# EAGLE design VactrolMixer (EAGLE 6.6.0)
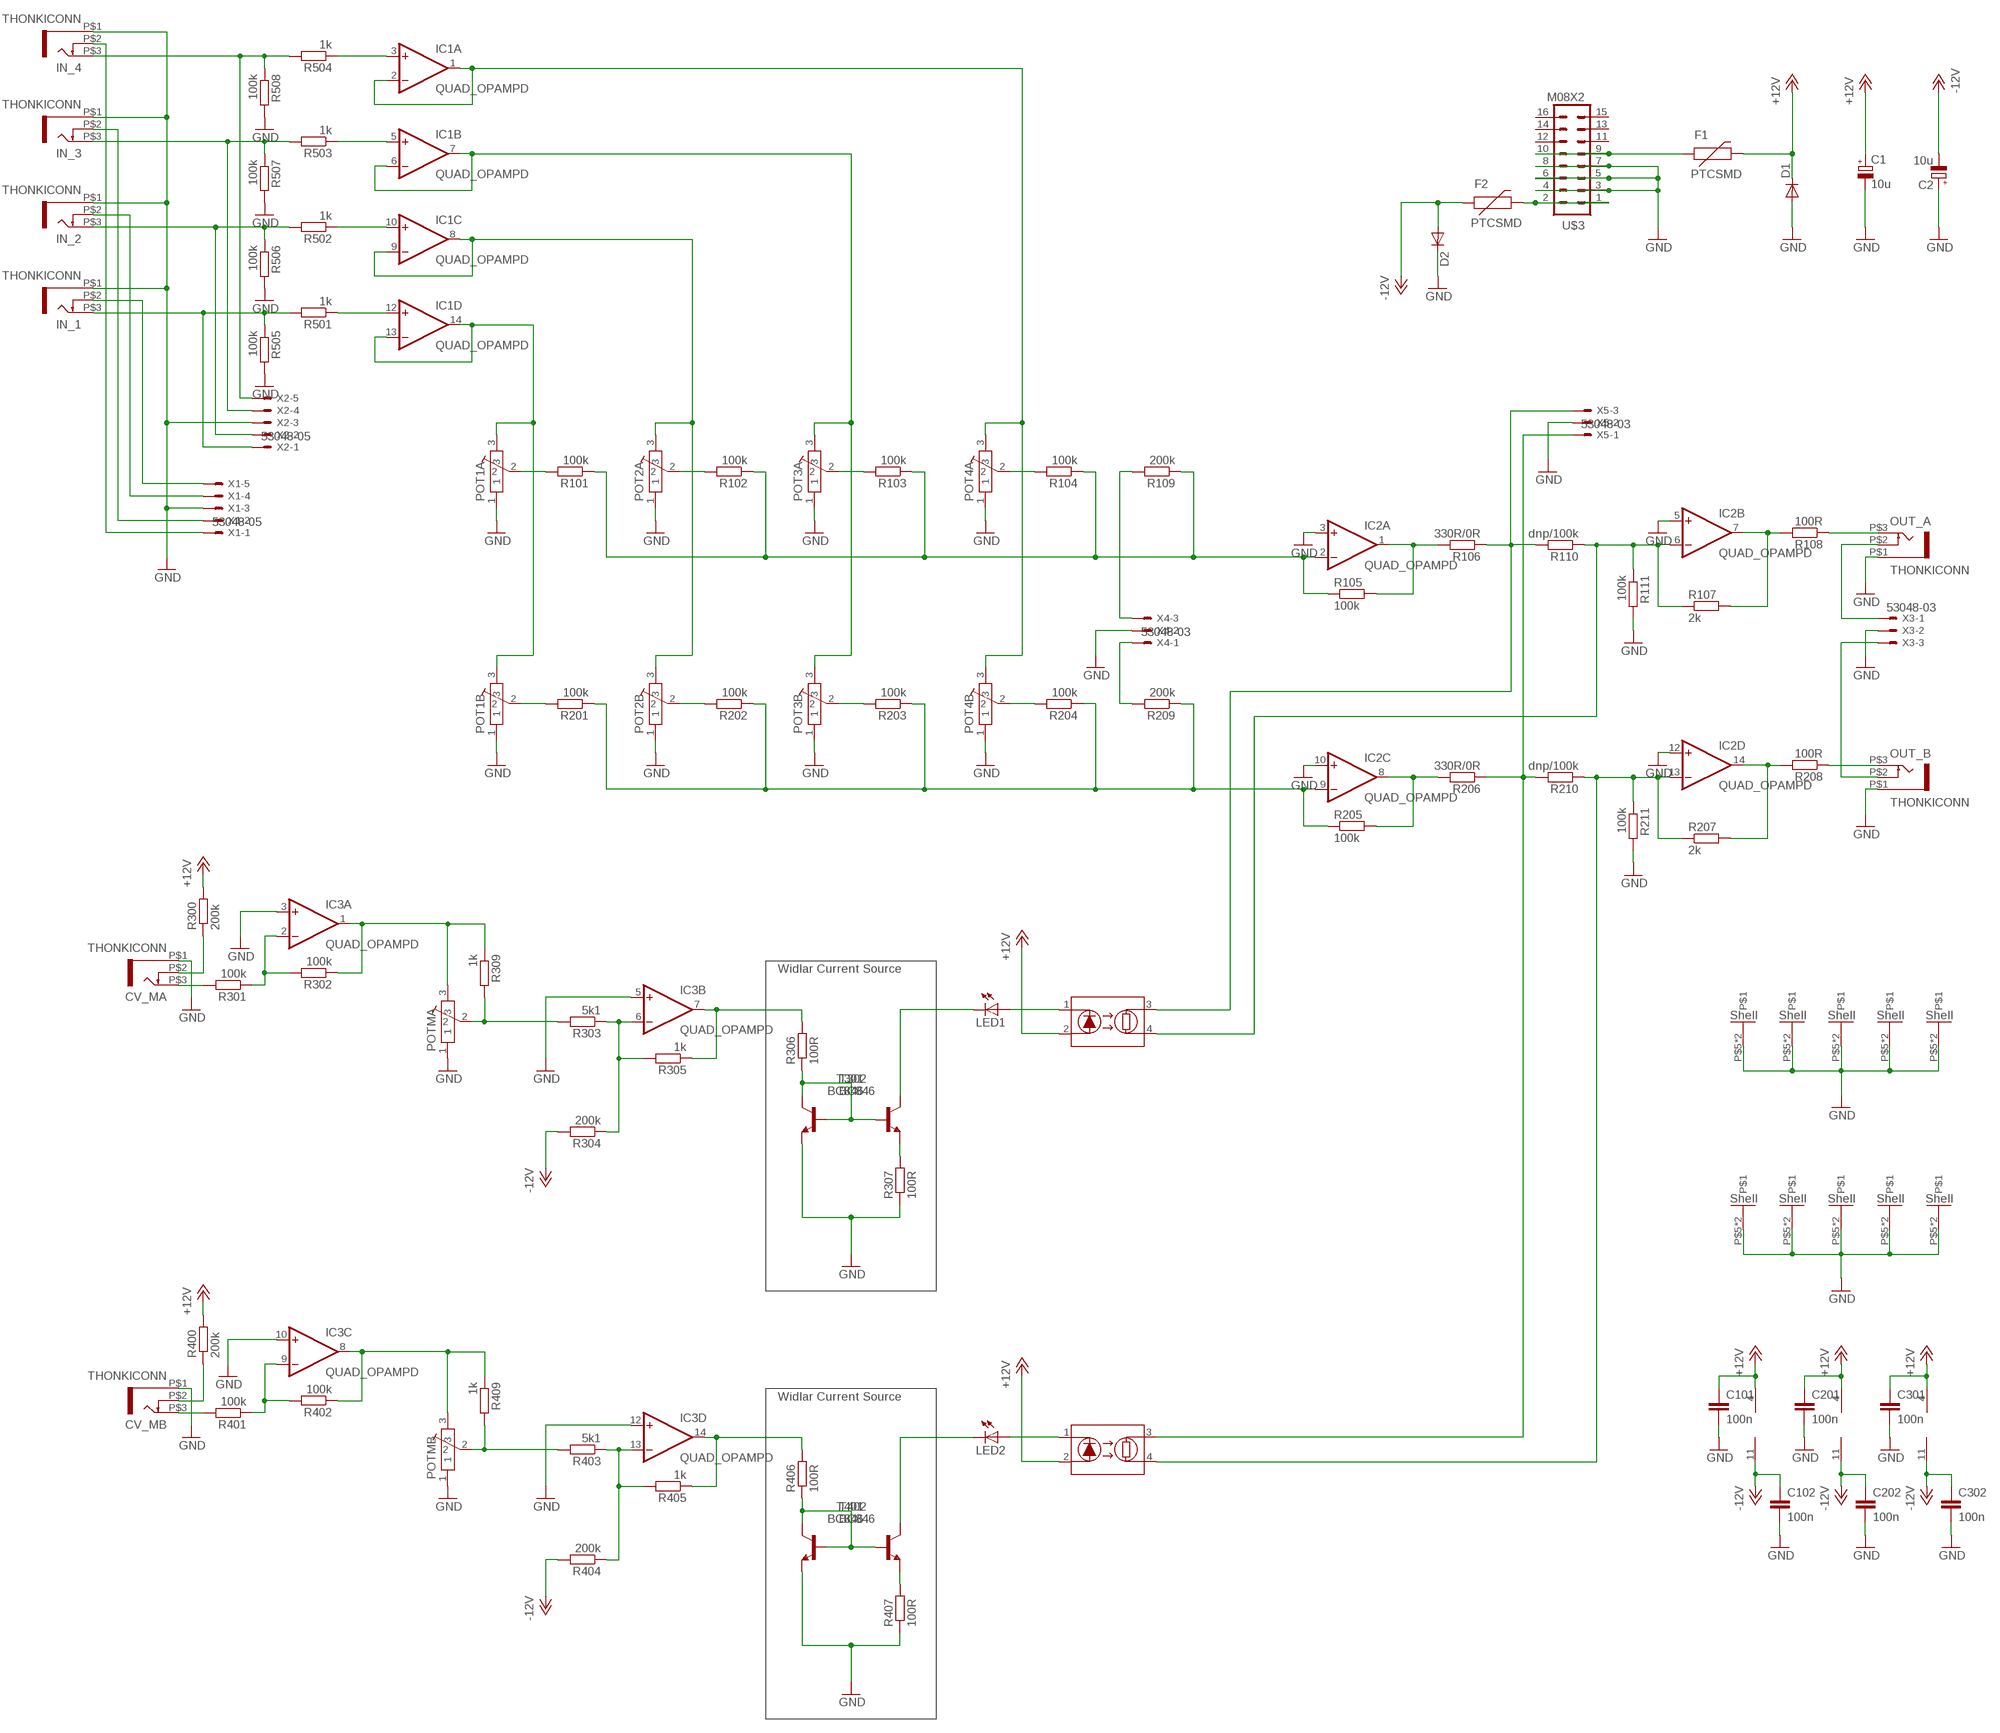
[diagram p0: schematic, sheet 1]

## Parts
C1  10u  CPOL-EU153CLV-0605  [153CLV-0605]
C2  10u  CPOL-EU153CLV-0605  [153CLV-0605]
C101  100n  C-EUC0603  [C0603]
C102  100n  C-EUC0603  [C0603]
C201  100n  C-EUC0603  [C0603]
C202  100n  C-EUC0603  [C0603]
C301  100n  C-EUC0603  [C0603]
C302  100n  C-EUC0603  [C0603]
CV_MA  THONKICONN  [THONKICONN]
CV_MB  THONKICONN  [THONKICONN]
D1  DIODESMA  [SMA-DIODE]
D2  DIODESMA  [SMA-DIODE]
F1  PTCSMD  [PTC-1206]
F2  PTCSMD  [PTC-1206]
IC1  QUAD_OPAMPD  [SO14]
IC2  QUAD_OPAMPD  [SO14]
IC3  QUAD_OPAMPD  [SO14]
IN_1  THONKICONN  [THONKICONN]
IN_2  THONKICONN  [THONKICONN]
IN_3  THONKICONN  [THONKICONN]
IN_4  THONKICONN  [THONKICONN]
LED1  LED3MM  [LED3MM]
LED2  LED3MM  [LED3MM]
OUT_A  THONKICONN  [THONKICONN]
OUT_B  THONKICONN  [THONKICONN]
POT1A  POT-ALPS-RK09L1140  [POT-ALPS-RK09L1140]
POT1B  POT-ALPS-RK09L1140  [POT-ALPS-RK09L1140]
POT2A  POT-ALPS-RK09L1140  [POT-ALPS-RK09L1140]
POT2B  POT-ALPS-RK09L1140  [POT-ALPS-RK09L1140]
POT3A  POT-ALPS-RK09L1140  [POT-ALPS-RK09L1140]
POT3B  POT-ALPS-RK09L1140  [POT-ALPS-RK09L1140]
POT4A  POT-ALPS-RK09L1140  [POT-ALPS-RK09L1140]
POT4B  POT-ALPS-RK09L1140  [POT-ALPS-RK09L1140]
POTMA  POT-ALPS-RK09L1140  [POT-ALPS-RK09L1140]
POTMB  POT-ALPS-RK09L1140  [POT-ALPS-RK09L1140]
R101  100k  R-EU_R0603  [R0603]
R102  100k  R-EU_R0603  [R0603]
R103  100k  R-EU_R0603  [R0603]
R104  100k  R-EU_R0603  [R0603]
R105  100k  R-EU_R0603  [R0603]
R106  330R/0R  R-EU_R0603  [R0603]
R107  2k  R-EU_R0603  [R0603]
R108  100R  R-EU_R0603  [R0603]
R109  200k  R-EU_R0603  [R0603]
R110  dnp/100k  R-EU_R0603  [R0603]
R111  100k  R-EU_R0603  [R0603]
R201  100k  R-EU_R0603  [R0603]
R202  100k  R-EU_R0603  [R0603]
R203  100k  R-EU_R0603  [R0603]
R204  100k  R-EU_R0603  [R0603]
R205  100k  R-EU_R0603  [R0603]
R206  330R/0R  R-EU_R0603  [R0603]
R207  2k  R-EU_R0603  [R0603]
R208  100R  R-EU_R0603  [R0603]
R209  200k  R-EU_R0603  [R0603]
R210  dnp/100k  R-EU_R0603  [R0603]
R211  100k  R-EU_R0603  [R0603]
R300  200k  R-EU_R0603  [R0603]
R301  100k  R-EU_R0603  [R0603]
R302  100k  R-EU_R0603  [R0603]
R303  5k1  R-EU_R0603  [R0603]
R304  200k  R-EU_R0603  [R0603]
R305  1k  R-EU_R0603  [R0603]
R306  100R  R-EU_R0603  [R0603]
R307  100R  R-EU_R0603  [R0603]
R309  1k  R-EU_R0603  [R0603]
R400  200k  R-EU_R0603  [R0603]
R401  100k  R-EU_R0603  [R0603]
R402  100k  R-EU_R0603  [R0603]
R403  5k1  R-EU_R0603  [R0603]
R404  200k  R-EU_R0603  [R0603]
R405  1k  R-EU_R0603  [R0603]
R406  100R  R-EU_R0603  [R0603]
R407  100R  R-EU_R0603  [R0603]
R409  1k  R-EU_R0603  [R0603]
R501  1k  R-EU_R0603  [R0603]
R502  1k  R-EU_R0603  [R0603]
R503  1k  R-EU_R0603  [R0603]
R504  1k  R-EU_R0603  [R0603]
R505  100k  R-EU_R0603  [R0603]
R506  100k  R-EU_R0603  [R0603]
R507  100k  R-EU_R0603  [R0603]
R508  100k  R-EU_R0603  [R0603]
T301  BC846  [SOT23]
T302  BC846  [SOT23]
T401  BC846  [SOT23]
T402  BC846  [SOT23]
U$3  M08X2  [2X8]
VAC1  VTL5C3  [VTL5C3]
VAC2  VTL5C3  [VTL5C3]
X1  53048-05  [53048-05]
X2  53048-05  [53048-05]
X3  53048-03  [53048-03]
X4  53048-03  [53048-03]
X5  53048-03  [53048-03]

## Nets
+12V: C1.+ C101.1 C201.1 C301.1 D1.C F1.2 IC1.4(P:V+) IC2.4(P:V+) IC3.4(P:V+) R300.2 R400.2 VAC1.2(LED+) VAC2.2(LED+)
-12V: C2.- C102.1 C202.1 C302.1 D2.A F2.1 IC1.11(P:V-) IC2.11(P:V-) IC3.11(P:V-) R304.2 R404.2
CV_SW_A: CV_MA.P$2 R300.1
CV_SW_B: CV_MB.P$2 R400.1
GND: C1.- C2.+ C101.2 C102.2 C201.2 C202.2 C301.2 C302.2 CV_MA.P$1 CV_MB.P$1 D1.A D2.C IC2.3(A:+IN) IC2.5(B:+IN) IC2.10(C:+IN) IC2.12(D:+IN) IC3.3(A:+IN) IC3.5(B:+IN) IC3.10(C:+IN) IC3.12(D:+IN) IN_1.P$1 IN_2.P$1 IN_3.P$1 IN_4.P$1 OUT_A.P$1 OUT_B.P$1 POT1A.1 POT1A.P$5 POT1A.P$6 POT1B.1 POT1B.P$5 POT1B.P$6 POT2A.1 POT2A.P$5 POT2A.P$6 POT2B.1 POT2B.P$5 POT2B.P$6 POT3A.1 POT3A.P$5 POT3A.P$6 POT3B.1 POT3B.P$5 POT3B.P$6 POT4A.1 POT4A.P$5 POT4A.P$6 POT4B.1 POT4B.P$5 POT4B.P$6 POTMA.1 POTMA.P$5 POTMA.P$6 POTMB.1 POTMB.P$5 POTMB.P$6 R111.2 R211.2 R307.1 R407.1 R505.2 R506.2 R507.2 R508.2 T301.2(E) T401.2(E) U$3.3 U$3.4 U$3.5 U$3.6 U$3.7 U$3.8 X1.3 X2.3 X3.2 X4.2 X5.2
IN_1: IN_1.P$3 R501.2 R505.1 X2.1
IN_2: IN_2.P$3 R502.2 R506.1 X2.2
IN_3: IN_3.P$3 R503.2 R507.1 X2.4
IN_4: IN_4.P$3 R504.2 R508.1 X2.5
IN_5_A: R109.2 X4.3
IN_5_B: R209.2 X4.1
INV_OUT_A: R106.1 R110.2 VAC1.3(LDRA) X5.3
INV_OUT_B: R206.1 R210.2 VAC2.3(LDRA) X5.1
N$1: IC2.7(B:OUT) R107.2 R108.2
N$2: POT2B.2 R202.2
N$6: IC1.3(A:+IN) R504.1
N$7: CV_MA.P$3 R301.2
N$8: IC2.1(A:OUT) R105.2 R106.2
N$9: IC2.8(C:OUT) R205.2 R206.2
N$10: POT3B.2 R203.2
N$11: IC2.6(B:-IN) R107.1 R110.1 R111.1 VAC1.4(LDRB)
N$13: POT1A.2 R101.2
N$14: IC2.14(D:OUT) R207.2 R208.2
N$15: LED2.A VAC2.1(LED-)
N$17: IC1.5(B:+IN) R503.1
N$19: POT4B.2 R204.2
N$20: CV_MB.P$3 R401.2
N$21: IC1.8(C:OUT) IC1.9(C:-IN) POT2A.3 POT2B.3
N$24: IC1.13(D:-IN) IC1.14(D:OUT) POT1A.3 POT1B.3
N$25: POT4A.2 R104.2
N$27: R407.2 T402.2(E)
N$28: R406.1 T401.1(B) T401.3(C) T402.1(B)
N$29: LED2.K(C) T402.3(C)
N$31: POT3A.2 R103.2
N$33: POT1B.2 R201.2
N$34: POT2A.2 R102.2
N$35: R307.2 T302.2(E)
N$36: IC2.13(D:-IN) R207.1 R210.1 R211.1 VAC2.4(LDRB)
N$39: LED1.A VAC1.1(LED-)
N$40: LED1.K(C) T302.3(C)
N$42: IC3.7(B:OUT) R305.1 R306.2
N$44: R306.1 T301.1(B) T301.3(C) T302.1(B)
N$46: IC2.9(C:-IN) R201.1 R202.1 R203.1 R204.1 R205.1 R209.1
N$48: IC1.10(C:+IN) R502.1
N$50: IC1.12(D:+IN) R501.1
N$52: IC2.2(A:-IN) R101.1 R102.1 R103.1 R104.1 R105.1 R109.1
N$53: IC1.6(B:-IN) IC1.7(B:OUT) POT3A.3 POT3B.3
N$56: F1.1 U$3.9 U$3.10
N$57: F2.2 U$3.1 U$3.2
N$58: IC1.1(A:OUT) IC1.2(A:-IN) POT4A.3 POT4B.3
N$59: IC3.2(A:-IN) R301.1 R302.2
N$61: IC3.1(A:OUT) POTMA.3 R302.1 R309.1
N$64: IC3.6(B:-IN) R303.1 R304.1 R305.2
N$65: POTMA.2 R303.2 R309.2
N$67: IC3.9(C:-IN) R401.1 R402.2
N$69: IC3.8(C:OUT) POTMB.3 R402.1 R409.1
N$71: IC3.14(D:OUT) R405.1 R406.2
N$72: IC3.13(D:-IN) R403.1 R404.1 R405.2
N$73: POTMB.2 R403.2 R409.2
OUT_A: OUT_A.P$3 R108.1
OUT_B: OUT_B.P$3 R208.1
SW_IN_1: IN_1.P$2 X1.5
SW_IN_2: IN_2.P$2 X1.4
SW_IN_3: IN_3.P$2 X1.2
SW_IN_4: IN_4.P$2 X1.1
SW_OUT_A: OUT_A.P$2 X3.1
SW_OUT_B: OUT_B.P$2 X3.3
Unconnected: U$3.11 U$3.12 U$3.13 U$3.14 U$3.15 U$3.16

## Notes on the sheet
- Widlar Current Source
- Widlar Current Source

## Library data of the parts
C1 C2 = resistor:CPOL-EU: POLARIZED CAPACITOR, European symbol
C101 C102 C201 C202 C301 C302 = resistor:C-EU: CAPACITOR, European symbol
CV_MA CV_MB IN_1-IN_4 OUT_A OUT_B = Rebel:THONKICONN
D1 D2 = SparkFun:DIODE: Diode These are standard reverse protection diodes and small signal diodes. SMA package can handle up to about 1A. SOD-323 can handle about 200mA. What the SOD-323 package when ordering, there are some mfgs out there that are 5-pin packages.
F1 F2 = SparkFun:PTC: Resettable Fuse PTC Resettable Fuse. Spark Fun Electronics SKU : COM-08357
IC1-IC3 = adafruit:QUAD_OPAMP: OP AMP Standard quad package
LED1 LED2 = Rebel:LED: LED
POT1A POT1B POT2A POT2B POT3A POT3B POT4A POT4B POTMA POTMB = Rebel:POT-ALPS-RK09L
R101-R111 R201-R211 R300-R307 R309 R400-R407 R409 R501-R508 = resistor:R-EU_: RESISTOR, European symbol
T301 T302 T401 T402 = transistor:BC846: NPN TRANSISTOR
U$3 = SparkFun:M08X2
VAC1 VAC2 = Pingdynasty:VTL5C3
X1 X2 = con-molex:53?-05: CONNECTOR wire to board 1.25 mm (.049 inch) pitch header; MF: MOLEX; MPN: 53048-0510; OC_FARNELL: 9732926; OC_NEWARK: 57H4722
X3-X5 = con-molex:53?-03: CONNECTOR wire to board 1.25 mm (.049 inch) pitch header; MF: WALDOM/MOLEX; MPN: 53048-0310; OC_FARNELL: 9732918; OC_NEWARK: 38C9908

## Board
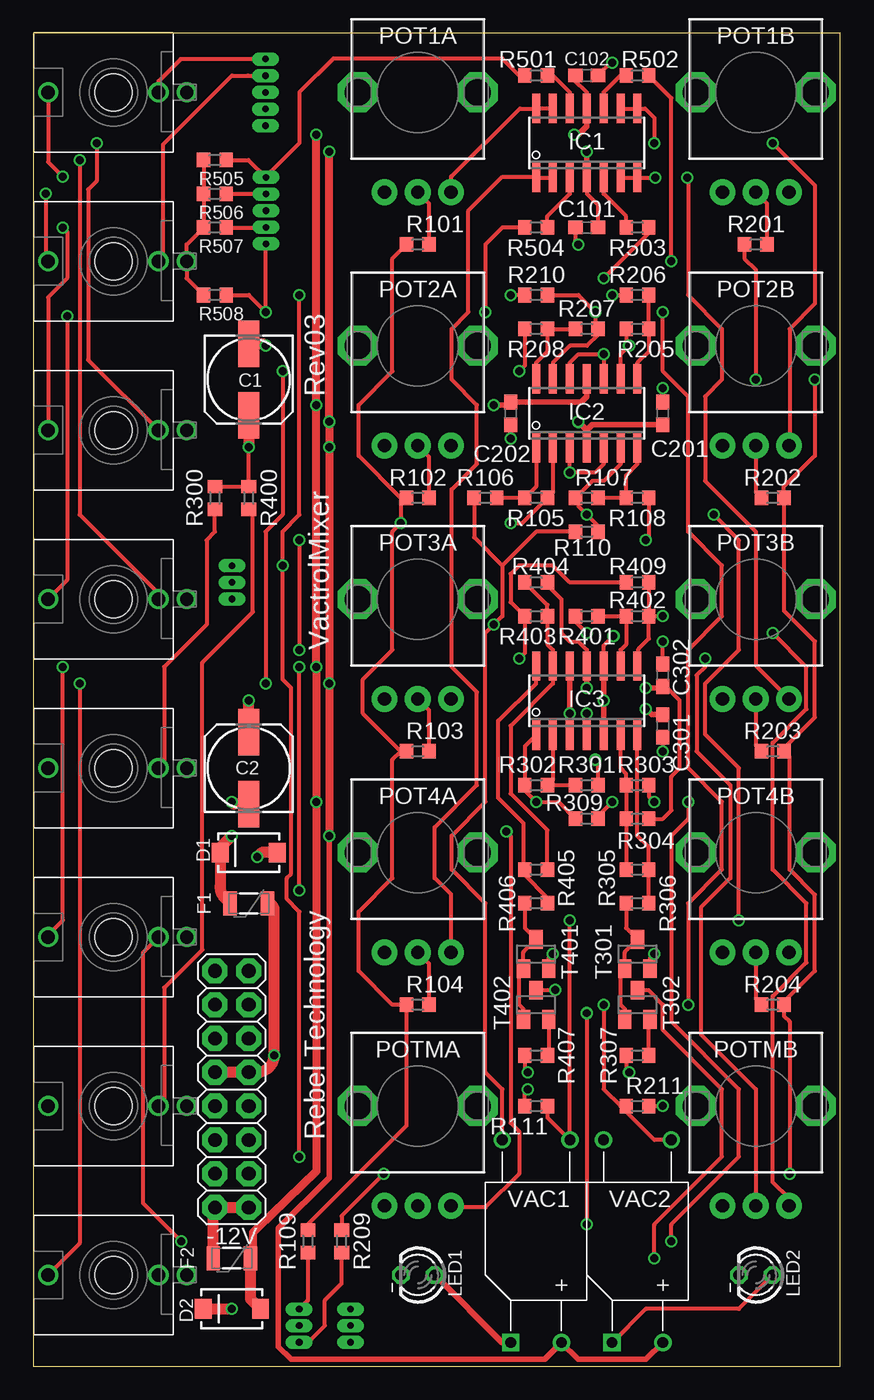
[diagram p1: board, top side]
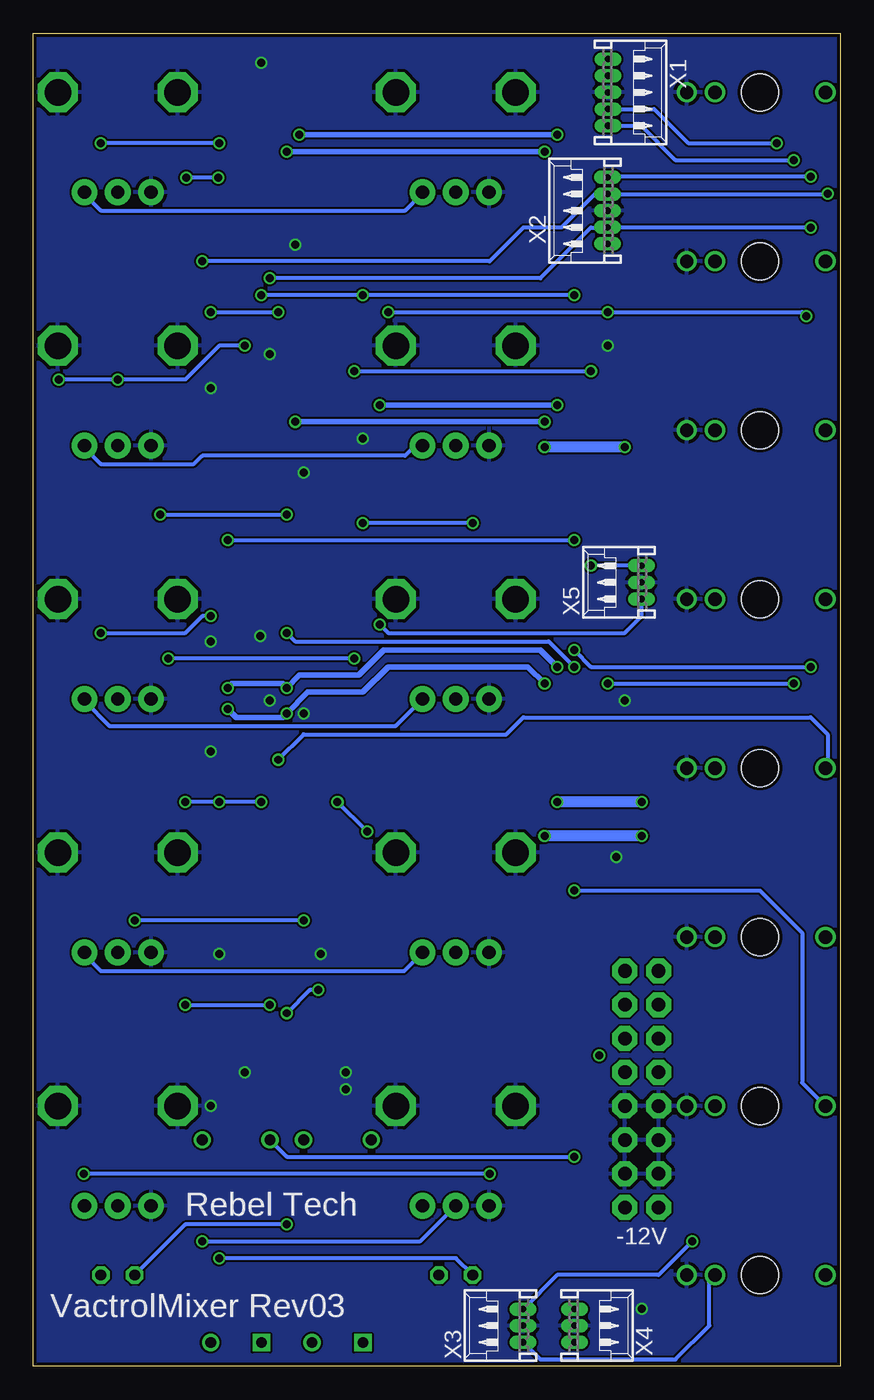
[diagram p2: board, bottom side, seen from below]

Size 60.64 x 100.2 mm. Coordinates in mm from the lower left corner, seen from the top.
Outline: 60.64,0 60.64,100.2 0,100.2 0,0 60.64,0
Copper layers (1*16): Top 0.035mm / dielectric 1.5mm / Bottom 0.035mm
Design rules "Fusion_eagle_rule_v1.1": minimum track width 6mil, minimum drill 12mil, track to track 6mil, track to pad 6mil, pad to pad 6mil, via to via 6mil, smd to smd 0mil, copper to edge 10mil, drill to drill 10mil, minimum pad ring 10mil, minimum via ring 6mil, stop-mask expansion 2mil, vias tented up to drill 100mil, thermal gap 10mil

### Footprints (pad centres in the part's own frame; a part is rotated, then mirrored left to right if it is on the bottom)
153CLV-0605 = smd 3.5 x 1.6: + 2.7,0; - -2.7,0
C0603 = smd 1.1 x 1: 1 -0.85,0; 2 0.85,0
THONKICONN = drill 1: P$1 0,-5.5; P$2 0,-3.38; P$3 0,4.92 | hole 2.8: 0,0
SMA-DIODE = smd 1.27 x 1.47: A -2.15,0; C 2.15,0
PTC-1206 = smd 1 x 1.8: 1 -1.4,0; 2 1.4,0
SO14 = smd 0.6 x 2.2: 1 -3.81,-2.6; 2 -2.54,-2.6; 3 -1.27,-2.6; 4 0,-2.6; 5 1.27,-2.6; 6 2.54,-2.6; 7 3.81,-2.6; 8 3.81,2.6; 9 2.54,2.6; 10 1.27,2.6; 11 0,2.6; 12 -1.27,2.6; 13 -2.54,2.6; 14 -3.81,2.6
LED3MM = drill 0.813 octagon: A -1.27,0; K 1.27,0
POT-ALPS-RK09L1140 = drill 1 pad 1.93: 1 -2.5,-7.5; 2 0,-7.5; 3 2.5,-7.5 | drill 2 octagon: P$5 -4.5,0; P$6 4.5,0
R0603 = smd 1 x 1.1: 1 -0.85,0; 2 0.85,0
SOT23 = smd 1 x 1.4: 1 -0.95,-1.1; 2 0.95,-1.1; 3 0,1.1
2X8 = drill 1.016 pad 1.88 octagon: 1 0,0; 2 0,2.54; 3 2.54,0; 4 2.54,2.54; 5 5.08,0; 6 5.08,2.54; 7 7.62,0; 8 7.62,2.54; 9 10.16,0; 10 10.16,2.54; 11 12.7,0; 12 12.7,2.54; 13 15.24,0; 14 15.24,2.54; 15 17.78,0; 16 17.78,2.54
VTL5C3 = drill 0.8 square: 1 -7.62,1.905 | drill 0.8: 2 -7.62,-1.905; 3 7.62,2.54; 4 7.62,-2.54
53048-05 = drill 0.5 pad 0.698 long: 1 2.5,-1.25; 2 1.25,-1.25; 3 0,-1.25; 4 -1.25,-1.25; 5 -2.5,-1.25
53048-03 = drill 0.5 pad 0.698 long: 1 1.25,-1.25; 2 0,-1.25; 3 -1.25,-1.25

### Placement (x,y rotation side)
C1  16.19,74.17 270 top
C2  16.19,44.96 90 top
C101  41.59,85.6 180 top
C102  41.59,97.03 0 top
C201  47.31,71.63 90 top
C202  35.88,71.63 270 top
C301  47.31,48.13 270 top
C302  47.31,51.94 90 top
CV_MA  6.03,44.96 90 top
CV_MB  6.03,19.56 90 top
D1  16.19,38.61 180 top
D2  14.92,4.32 180 top
F1  16.19,34.8 180 top
F2  14.92,8.13 180 top
IC1  41.59,91.95 0 top
IC2  41.59,71.63 0 top
IC3  41.59,50.04 0 top
IN_1  6.03,95.76 90 top
IN_2  6.03,83.06 90 top
IN_3  6.03,70.36 90 top
IN_4  6.03,57.66 90 top
LED1  28.89,6.86 180 top
LED2  54.29,6.86 180 top
OUT_A  6.03,32.26 90 top
OUT_B  6.03,6.86 90 top
POT1A  28.89,95.76 0 top
POT1B  54.29,95.76 0 top
POT2A  28.89,76.71 0 top
POT2B  54.29,76.71 0 top
POT3A  28.89,57.66 0 top
POT3B  54.29,57.66 0 top
POT4A  28.89,38.61 0 top
POT4B  54.29,38.61 0 top
POTMA  28.89,19.56 0 top
POTMB  54.29,19.56 0 top
R101  28.89,84.33 0 top
R102  28.89,65.28 0 top
R103  28.89,46.23 0 top
R104  28.89,27.18 0 top
R105  37.78,65.28 180 top
R106  33.97,65.28 0 top
R107  41.59,65.28 0 top
R108  45.4,65.28 180 top
R109  20.64,9.4 270 top
R110  41.59,62.74 180 top
R111  37.78,19.56 180 top
R201  54.29,84.33 0 top
R202  55.56,65.28 180 top
R203  55.56,46.23 180 top
R204  55.56,27.18 180 top
R205  45.4,77.98 0 top
R206  45.4,80.52 0 top
R207  41.59,77.98 180 top
R208  37.78,77.98 0 top
R209  23.18,9.4 270 top
R210  37.78,80.52 180 top
R211  45.4,19.56 0 top
R300  13.65,65.28 90 top
R301  41.59,43.69 0 top
R302  37.78,43.69 0 top
R303  45.4,43.69 0 top
R304  45.4,41.15 0 top
R305  45.4,37.34 180 top
R306  45.4,34.8 0 top
R307  45.4,23.37 0 top
R309  41.59,41.15 0 top
R400  16.19,65.28 90 top
R401  41.59,56.39 180 top
R402  45.4,56.39 180 top
R403  37.78,56.39 180 top
R404  37.78,58.93 0 top
R405  37.78,37.34 0 top
R406  37.78,34.8 0 top
R407  37.78,23.37 0 top
R409  45.4,58.93 180 top
R501  37.78,97.03 180 top
R502  45.4,97.03 0 top
R503  45.4,85.6 0 top
R504  37.78,85.6 180 top
R505  13.65,90.68 180 top
R506  13.65,88.14 180 top
R507  13.65,85.6 180 top
R508  13.65,80.52 180 top
T301  45.4,30.99 0 top
T302  45.4,27.18 0 top
T401  37.78,30.99 0 top
T402  37.78,27.18 0 top
U$3  16.19,11.94 90 top
VAC1  37.78,9.4 90 top
VAC2  45.4,9.4 90 top
X1  16.19,95.76 270 bottom
X2  18.73,86.87 90 bottom
X3  25.08,3.05 90 bottom
X4  18.73,3.05 270 bottom
X5  16.19,58.93 90 bottom

### Tracks (layer width: path | path; a pad name or v marks a point on that pad's centre or on a via)
+12V  (via drill 0.6)
  Top 0.305: R300.2 R400.2 v16.19,69.09 | IC1.4 41.59,88.14 42.44,87.29 C101.1
  Top 0.406: v22.22,39.88 22.22,14.16 18.42,10.35 18.42,1.46 19.37,0.51 38.42,0.51 VAC1.2 40.96,0.51 46.04,0.51 VAC2.2 | v41.59,91.31 IC1.4 | IC2.4 41.59,70.36 | 41.59,70.36 v40.96,70.99 | C201.1 42.01,70.78 41.59,70.36 | IC3.4 v41.59,49.09 | C301.1 46.46,48.98 v46.04,49.4
  Top 0.61: v22.22,91.31 v22.22,70.99 v22.22,69.09 v22.22,51.31 v22.22,39.88
  Top 0.813: F1.2 14.41,35.18 arc-45 14.04,36.07 D1.C 14.04,39 v14.92,39.88 | C1.+ v16.19,69.09
  Bottom 0.406: v40.96,70.99 v22.22,70.99 | v22.22,51.31 23.49,52.58 33.97,52.58 35.88,50.67 40.01,50.67 v41.59,49.09 41.91,48.77 45.4,48.77 v46.04,49.4 | v22.22,91.31 v41.59,91.31
  Bottom 0.813: v16.19,69.09 v22.22,69.09 | v14.92,39.88 v22.22,39.88
-12V  (via drill 0.6)
  Top 0.305: R404.2 38.63,58.71 39.69,57.66 39.69,55.12 40.32,54.48 40.96,54.48 41.59,53.85 IC3.11 | R304.2 47.31,41.15 47.94,41.78 47.94,44.32 48.58,44.96 48.58,50.04 47.52,51.09 C302.1 | IC1.11 41.59,95.76 40.74,96.61 C102.1 | 21.27,14.79 21.27,14.67
  Top 0.406: IC1.11 41.59,93.22 40.96,92.58 v40.64,92.58 | IC2.11 41.59,72.9 41.17,72.48 C202.1 35.66,72.26 v34.61,72.26 | v46.04,50.99 47.2,50.99 C302.1 | IC3.11 v41.59,50.99
  Top 0.61: v21.27,92.58 v21.27,72.26 v21.27,52.58 v21.27,42.42 21.27,14.79 | 21.27,14.67 16.83,10.35 16.51,10.03 16.51,8.76 16.19,8.45 16.32,8.32 F2.1
  Top 0.813: C2.- 15.08,42.26 v14.92,42.42 | F2.1 16.32,5.07 D2.A
  Bottom 0.406: v34.61,72.26 v21.27,72.26 | v21.27,52.58 22.54,53.85 34.29,53.85 36.19,51.94 40.64,51.94 v41.59,50.99 41.91,51.31 45.72,51.31 v46.04,50.99 | v21.27,92.58 v40.64,92.58
  Bottom 0.813: v14.92,42.42 v21.27,42.42
CV_SW_A
  Top 0.305: 13.65,64.01 R300.1 13.65,62.74 13.02,62.1 13.02,55.75 9.84,52.58 9.84,45.39 CV_MA.P$2
CV_SW_B
  Top 0.305: R400.1 16.19,64.33 16.51,64.01 16.51,56.71 12.7,52.89 12.7,31.31 9.84,28.45 9.84,19.99 CV_MB.P$2
GND  (via drill 0.6)
  Top 0.305: IC2.12 40.32,75.44 40.96,76.07 v42.86,76.07 IC2.10 | IC2.5 42.86,67.82 42.23,67.18 v40.32,67.18 IC2.3 | R307.1 44.55,22.31 v44.77,22.1 | R407.1 36.93,22.31 v37.15,22.1 | T401.2 38.73,30.67 v39.05,30.99 | T301.2 46.35,30.67 v46.67,30.99 | C102.2 42.44,97.24 v43.5,97.98 | C101.2 40.74,84.54 v40.96,84.33 | C301.2 v47.31,46.23 | C302.2 v47.31,54.48 | IC3.10 42.86,54.17 v43.6,54.9 | R111.2 36.93,20.61 v37.15,20.83 | R211.2 v47.31,19.56 | R505.2 R506.2 R507.2 11.53,84.33 IN_2.P$1 11.53,81.79 R508.2
  Top 0.406: C201.2 v47.31,73.53 | C202.2 v35.88,69.72 | IC3.10 v42.86,50.04 IC3.5 | IC3.12 v40.32,49.09 IC3.3
  Top 0.813: C1.- 17.3,76.87 v17.46,76.71 | C2.+ v16.19,50.04 | D1.A 17.15,38.61 v16.83,38.29 | D2.C v14.92,4.32
  pour Bottom: -1.59,102.11 -1.59,-0.76 60.64,-0.76 60.64,102.11
IN_1  (via drill 0.6)
  Top 0.305: R501.2 36.51,97.03 35.24,98.3 22.54,98.3 20,95.76 20,91.95 17.42,89.37 X2.1 16.17,90.68 R505.1 | IN_1.P$3 1.11,90.52 v2.22,89.41
  Bottom 0.305: v2.22,89.41 17.44,89.41 X2.1
IN_2  (via drill 0.6)
  Top 0.305: v47.94,83.06 47.94,95.34 R502.2 | v0.95,88.14 0.95,83.22 IN_2.P$3 | R506.1 17.46,88.14 X2.2
  Bottom 0.305: v47.94,83.06 26.35,83.06 23.81,85.6 20.96,85.6 18.42,88.14 17.5,88.14 X2.2 0.97,88.12 v0.95,88.14
IN_3  (via drill 0.6)
  Top 0.305: v42.86,81.79 46.25,85.18 R503.2 | v2.22,85.6 2.54,85.28 2.54,81.78 1.11,80.36 IN_3.P$3 | R507.1 17.46,85.6 X2.4
  Bottom 0.305: v42.86,81.79 22.54,81.79 18.73,85.6 17.5,85.6 X2.4 17.46,85.6 v2.22,85.6
IN_4  (via drill 0.6)
  Top 0.305: R504.2 35.24,85.6 33.97,84.33 v33.97,79.25 | v2.54,78.93 2.54,59.09 IN_4.P$3 | X2.5 17.46,84.35 v17.46,79.25 16.19,80.52 R508.1
  Bottom 0.305: v33.97,79.25 v17.46,79.25 2.86,79.25 v2.54,78.93
IN_5_A
  Top 0.305: R109.2 20.64,4.95 X4.3
IN_5_B
  Top 0.305: X4.1 20.66,1.8 21.91,3.05 21.91,4.95 23.18,6.22 R209.2
INV_OUT_A  (via drill 0.6)
  Top 0.305: VAC1.3 35.24,20.83 33.97,22.1 33.97,34.8 31.43,37.34 31.43,39.88 33.97,42.42 33.97,55.12 v34.61,55.75 35.24,56.39 35.24,60.2 | R106.1 33.12,62.32 35.24,60.2 | R110.2 37.78,62.74 35.24,60.2
  Bottom 0.305: v34.61,55.75 33.97,55.12 16.19,55.12 14.94,56.37 X5.3
INV_OUT_B  (via drill 0.6)
  Top 0.305: v20,80.52 20,64.01 18.73,62.74 v18.73,60.2 18.73,51.63 19.37,50.99 19.37,37.02 19.05,36.7 19.05,35.12 20,34.16 v20,15.75 | v43.5,80.52 R206.1 | R210.2 v35.88,80.52
  Bottom 0.305: v20,80.52 v35.88,80.52 v43.5,80.52 | VAC2.3 41.59,15.75 v20,15.75 | X5.1 18.71,60.18 v18.73,60.2
N$1
  Top 0.305: R107.2 R108.2 44.55,66.97 45.4,67.82 IC2.7
N$2
  Top 0.305: POT2B.2 54.29,65.7 R202.2
N$6
  Top 0.305: R504.1 38.63,86.45 40.32,88.14 IC1.3
N$7  (via drill 0.6)
  Top 0.305: R301.2 42.44,45.38 v42.23,45.59
  Bottom 0.305: v42.23,45.59 40.32,47.5 25.08,47.5 23.81,48.77 2.22,48.77 0.95,47.5 0.95,45.12 CV_MA.P$3
N$8
  Top 0.305: R106.2 R105.2 37.78,66.13 IC2.1
N$9
  Top 0.305: IC2.8 45.4,75.44 46.25,76.29 R205.2 R206.2
N$10
  Top 0.305: POT3B.2 54.29,46.65 R203.2
N$11  (via drill 0.6)
  Top 0.305: IC2.6 44.13,67.82 42.86,66.55 42.01,66.55 R107.1 40.96,65.06 40.96,64.64 v41.59,64.01 42.44,63.16 R110.1 | v40.32,33.53 VAC1.4 38.63,18.71 R111.1 | v53.02,33.53 53.02,44.96 50.48,47.5 50.48,51.31 53.02,53.85 53.02,62.1 v51.12,64.01
  Bottom 0.305: v40.32,33.53 v53.02,33.53 | v51.12,64.01 v41.59,64.01
N$13
  Top 0.305: R101.2 29.74,87.41 POT1A.2
N$14
  Top 0.305: R207.2 R208.2 38.63,76.29 37.78,75.44 IC2.14
N$15
  Top 0.305: LED2.A 53.02,4.32 46.04,4.32 VAC2.1
N$17
  Top 0.305: R503.1 44.55,86.45 42.86,88.14 IC1.5
N$19
  Top 0.305: POT4B.2 54.29,27.6 R204.2
N$20  (via drill 0.6)
  Top 0.305: R401.2 40.74,55.97 v41.59,55.12 | v20,35.75 v20,52.58
  Bottom 0.305: v41.59,55.12 40.96,54.48 21.91,54.48 v20,52.58 | v20,35.75 6.03,35.75 2.86,32.58 2.86,21.3 CV_MB.P$3
N$21  (via drill 0.6)
  Top 0.305: IC1.9 IC1.8 45.98,94.55 46.67,93.85 v46.67,91.95 | v55.56,91.95 58.74,88.77 58.74,79.88 56.83,77.98 56.83,69.25 POT2B.3
  Bottom 0.305: POT2B.3 56.79,69.05 55.56,67.82 48.58,67.82 47.94,68.45 32.7,68.45 31.95,69.21 POT2A.3 | v46.67,91.95 v55.56,91.95
N$24
  Top 0.305: IC1.13 IC1.14 36.57,94.55 36.51,94.49 31.39,89.43 POT1A.3
  Bottom 0.305: POT1B.3 56.79,88.1 55.56,86.87 32.7,86.87 31.43,88.14 31.43,88.22 POT1A.3
N$25
  Top 0.305: R104.2 29.74,30.26 POT4A.2
N$27
  Top 0.305: T402.2 38.73,23.47 R407.2
N$28
  Top 0.305: T402.1 36.83,26.86 36.51,27.18 36.51,29.57 T401.1 36.83,31.14 T401.3 36.93,32.94 R406.1
N$29  (via drill 0.6)
  Top 0.305: T402.3 v39.22,28.28 | v41.59,26.54 v41.59,10.67
  Bottom 0.305: v39.22,28.28 39.86,28.28 v41.59,26.54 | v41.59,10.67 49.21,10.67 LED2.K
N$31
  Top 0.305: R103.2 29.74,49.31 POT3A.2
N$33
  Top 0.305: R201.2 55.14,87.41 POT1B.2
N$34
  Top 0.305: R102.2 29.74,68.36 POT2A.2
N$35
  Top 0.305: R307.2 46.25,25.98 T302.2
N$36  (via drill 0.6)
  Top 0.305: IC2.13 39.05,75.44 40.32,76.71 41.59,76.71 42.44,77.56 R207.1 42.23,78.19 v42.23,79.25 40.96,80.52 R210.1 | v47.31,79.25 47.31,74.8 49.21,72.9 49.21,62.74 51.75,60.2 51.75,56.39 49.21,53.85 49.21,44.96 51.75,42.42 51.75,37.34 49.21,34.8 v49.21,27.18 | v42.86,27.18 42.86,20.83 44.13,19.56 R211.1 44.55,19.14 46.67,17.02 VAC2.4
  Bottom 0.305: v47.31,79.25 v42.23,79.25 | v49.21,27.18 v42.86,27.18
N$39
  Top 0.406: VAC1.1 35.24,1.78 LED1.A
N$40  (via drill 0.6)
  Top 0.305: T302.3 46.21,28.28 47.31,27.18 47.31,25.27 51.75,20.83 51.75,15.75 46.67,10.67 v46.67,8.13
  Bottom 0.305: LED1.K 28.89,8.13 v46.67,8.13
N$42
  Top 0.305: IC3.7 45.4,39.88 46.25,39.03 R305.1 R306.2
N$44
  Top 0.305: R306.1 44.55,32.94 T301.3 44.45,31.14 T301.1 44.13,29.57 44.13,27.18 44.45,26.86 T302.1
N$46  (via drill 0.6)
  Top 0.305: v54.29,74.17 54.29,82.42 53.44,83.27 R201.1 | IC2.9 44.13,76.07 v44.77,76.71 44.55,76.92 R205.1 | v26.35,14.48 23.18,11.3 R209.1 | v56.83,14.48 56.83,25.91 56.41,26.33 R204.1 56.41,27.39 58.74,29.72 58.74,35.43 56.83,37.34 56.83,45.81 R203.1 56.41,46.44 58.74,48.77 58.74,54.48 56.41,56.81 R202.1 56.41,66.13 58.74,68.45 v58.74,74.17
  Bottom 0.305: v58.74,74.17 v54.29,74.17 49.21,74.17 46.67,76.71 v44.77,76.71 | v26.35,14.48 v56.83,14.48
N$48
  Top 0.305: R502.1 44.55,97.45 42.86,95.76 IC1.10
N$50
  Top 0.305: R501.1 38.63,97.45 40.32,95.76 IC1.12
N$52  (via drill 0.6)
  Top 0.305: v35.88,63.37 36.73,63.37 R105.1 39.05,65.7 IC2.2 | 27.62,65.28 24.45,68.45 24.45,72.26 26.99,74.8 26.99,83.27 R101.1 | R109.1 20.64,10.67 28.04,18.07 R104.1 26.99,27.18 24.45,29.72 24.45,34.16 26.99,36.7 26.99,45.59 27.62,46.23 | 27.62,46.23 24.76,49.09 24.76,51.63 26.99,53.85 26.99,62.74 v27.62,63.37 27.62,65.28 | 27.62,46.23 R103.1 | R102.1 27.62,65.28
  Bottom 0.305: v27.62,63.37 v35.88,63.37
N$53  (via drill 0.6)
  Top 0.305: IC1.6 IC1.7 v46.73,89.35 | POT3B.3 54.29,52.66 54.29,62.74 50.48,66.55 50.48,72.9 51.75,74.17 51.75,77.98 49.21,80.52 49.21,89.29 v49.15,89.35
  Bottom 0.305: POT3B.3 56.79,50 54.93,48.13 33.42,48.13 POT3A.3 | v46.73,89.35 v49.15,89.35
N$56  (via drill 0.6)
  Top 0.813: 17.68,34.58 arc-45 F1.1 arc-90 18.1,34.29 v18.1,23.37 arc-90 16.83,22.1 U$3.9 U$3.10
N$57
  Top 0.813: U$3.1 U$3.2 13.52,11.81 F2.2
N$58
  Top 0.305: IC1.2 IC1.1 37.72,89.41 35.24,89.41 32.7,86.87 32.7,79.25 31.43,77.98 31.43,74.17 33.34,72.26 33.34,67.82 31.43,65.91 31.43,52.58 33.34,50.67 33.34,43.69 30.16,40.51 30.16,36.7 31.39,35.47 POT4A.3
  Bottom 0.305: POT4B.3 56.79,30.95 55.56,29.72 32.78,29.72 POT4A.3
N$59
  Top 0.305: IC3.2 39.05,44.11 R302.2 R301.1
N$61  (via drill 0.6)
  Top 0.305: IC3.1 36.93,46.59 R302.1 36.93,43.27 v37.78,42.42 39.47,42.42 R309.1 | POTMA.3 31.51,11.94 33.97,11.94 36.51,14.48 36.51,17.65 35.88,18.29 35.88,39.88 v35.56,40.2
  Bottom 0.305: v35.56,40.2 v37.78,42.42
N$64
  Top 0.305: IC3.6 44.13,44.96 44.55,44.54 R303.1 R304.1 R305.2
N$65  (via drill 0.6)
  Top 0.305: v49.21,42.42 49.21,41.15 47.94,39.88 47.94,25.91 53.02,20.83 53.02,15.75 47.94,10.67 v47.94,9.4 | R303.2 46.25,42.84 v46.67,42.42 | R309.2 42.44,41.36 v43.5,42.42
  Bottom 0.305: v49.21,42.42 v46.67,42.42 v43.5,42.42 | v47.94,9.4 31.55,9.4 POTMA.2
N$67
  Top 0.305: IC3.9 44.13,53.85 44.55,54.27 R402.2 R401.1
N$69  (via drill 0.6)
  Top 0.305: POTMB.3 56.79,12.61 55.56,13.84 55.56,27.81 58.1,30.35 58.1,34.8 55.56,37.34 55.56,46.86 58.1,49.4 58.1,52.58 v55.56,55.12 | IC3.8 45.46,53.91 46.25,54.7 R402.1 | R402.1 v47.31,56.39 | R409.1 R402.1
  Bottom 0.305: v55.56,55.12 49.21,55.12 47.94,56.39 v47.31,56.39
N$71
  Top 0.305: R406.2 38.63,35.22 36.93,36.92 R405.1 36.83,37.44 36.83,40.83 34.93,42.74 34.93,48.51 37.78,51.31 IC3.14
N$72
  Top 0.305: R404.1 38.63,57.23 R403.1 38.63,54.27 39.05,53.85 IC3.13 39.05,51.31 35.88,48.13 35.88,43.05 38.63,40.3 R405.2
N$73  (via drill 0.6)
  Top 0.305: v36.51,53.21 36.93,53.63 R403.2 35.88,57.44 35.88,59.56 36.51,60.2 39.05,60.2 40.32,58.93 R409.2 | v50.48,53.21 50.48,52.58 49.85,51.94 49.85,46.23 52.39,43.69 52.39,36.7 50.16,34.48 50.16,24.96 54.29,20.83 POTMB.2
  Bottom 0.305: v36.51,53.21 v50.48,53.21
OUT_A  (via drill 0.6)
  Top 0.305: R108.1 46.25,62.32 v46.04,62.1 | v20,62.1 v20,53.85 | OUT_A.P$3 1.11,32.42 2.22,33.53 v2.22,52.58
  Bottom 0.305: v46.04,62.1 v20,62.1 | v20,53.85 18.73,52.58 v2.22,52.58
OUT_B  (via drill 0.6)
  Top 0.305: R208.1 36.93,75.22 v36.51,74.8 | v18.73,74.8 18.73,64.01 17.46,62.74 v17.46,51.31 | v3.49,51.31 3.49,9.24 OUT_B.P$3
  Bottom 0.305: v36.51,74.8 v18.73,74.8 | v17.46,51.31 v3.49,51.31
SW_IN_1
  Top 0.305: X1.5 11.07,98.26 9.41,96.6 IN_1.P$2
SW_IN_2
  Top 0.305: X1.4 16.15,97.03 14.92,97.03 9.73,91.83 9.73,83.38 IN_2.P$2
SW_IN_3  (via drill 0.6)
  Top 0.305: v4.76,91.95 4.76,89.09 4.13,88.46 4.13,75.64 IN_3.P$2
  Bottom 0.305: X1.2 13.99,94.51 11.43,91.95 v4.76,91.95
SW_IN_4  (via drill 0.6)
  Top 0.305: v3.49,90.68 3.49,64.01 9.41,58.09 IN_4.P$2
  Bottom 0.305: X1.1 14.96,93.26 12.38,90.68 v3.49,90.68
SW_OUT_A  (via drill 0.6)
  Top 0.305: OUT_A.P$2 8.25,31.1 8.25,12.26 v11.11,9.4
  Bottom 0.305: v11.11,9.4 13.65,6.86 21.27,6.86 X3.1
SW_OUT_B
  Bottom 0.305: X3.3 22.54,0.51 12.38,0.51 9.84,3.05 9.84,6.43 OUT_B.P$2

### Text on the board
tPlace: Rev03 | VactrolMixer | Rebel Technology
bPlace: Rebel Tech | -12V | VactrolMixer Rev03
tNames: -12V